# EAGLE design untitled (EAGLE 5.11)
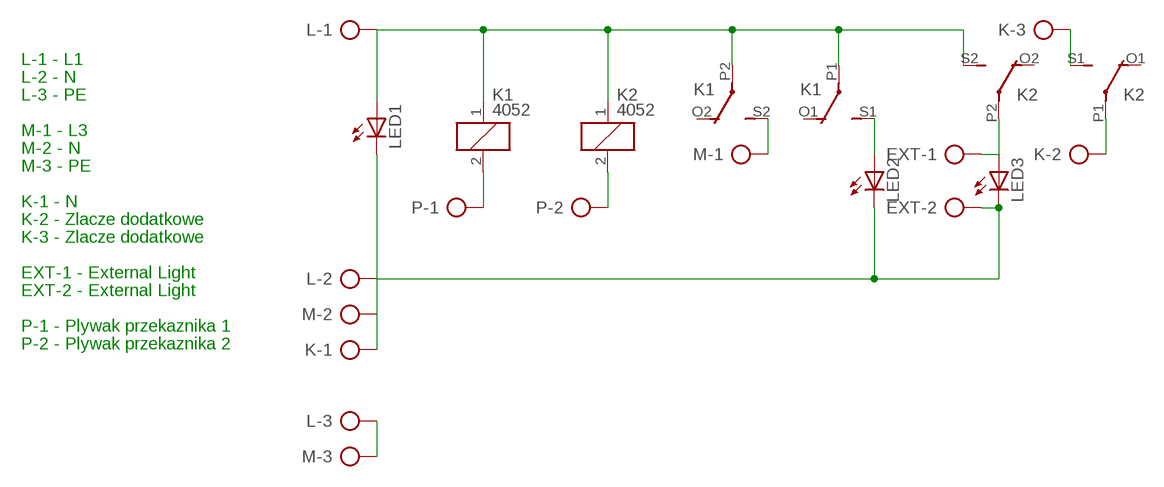
[diagram p0: schematic, sheet 1]

## Parts
EXT  AK500/2  [AK500/2]
K  AK500/3  [AK500/3]
K1  4052  [F4052]
K2  4052  [F4052]
L  AK500/3  [AK500/3]
LED1  1  [1]
LED2  1  [1]
LED3  1  [1]
M  AK500/3  [AK500/3]
P  AK500/2  [AK500/2]

## Nets
N$1: L.3 M.3
N$2: K1.1 K1.P1(2:P) K1.P2(3:P) K2.1 K2.S2(3:S) L.1 LED1.A
N$3: EXT.2 K.1 L.2 LED1.K(C) LED2.K(C) LED3.K(C) M.2
N$4: K1.2 P.1
N$5: K2.2 P.2
N$6: K1.S2(3:S) M.1
N$7: K1.S1(2:S) LED2.A
N$8: EXT.1 K2.P2(3:P) LED3.A
N$9: K2.S1(2:S) K.3
N$10: K2.P1(2:P) K.2
Unconnected: K1.O1(2:O) K1.O2(3:O) K2.O1(2:O) K2.O2(3:O)

## Notes on the sheet
- L-1 - L1
- L-2 - N
- L-3 - PE
- M-1 - L3
- M-2 - N
- M-3 - PE
- K-1 - N
- K-2 - Zlacze dodatkowe
- K-3 - Zlacze dodatkowe
- EXT-1 - External Light
- EXT-2 - External Light
- P-1 - Plywak przekaznika 1
- P-2 - Plywak przekaznika 2

## Library data of the parts
EXT P = con-ptr500:AK500/2: CONNECTOR; OC_FARNELL: unknown; OC_NEWARK: unknown
K L M = con-ptr500:AK500/3: CONNECTOR; OC_FARNELL: unknown; OC_NEWARK: unknown
K1 K2 = relay:4052: RELAY 2 x switch, Finder; OC_FARNELL: unknown; OC_NEWARK: unknown
LED1-LED3 = LEDm:1

## Board
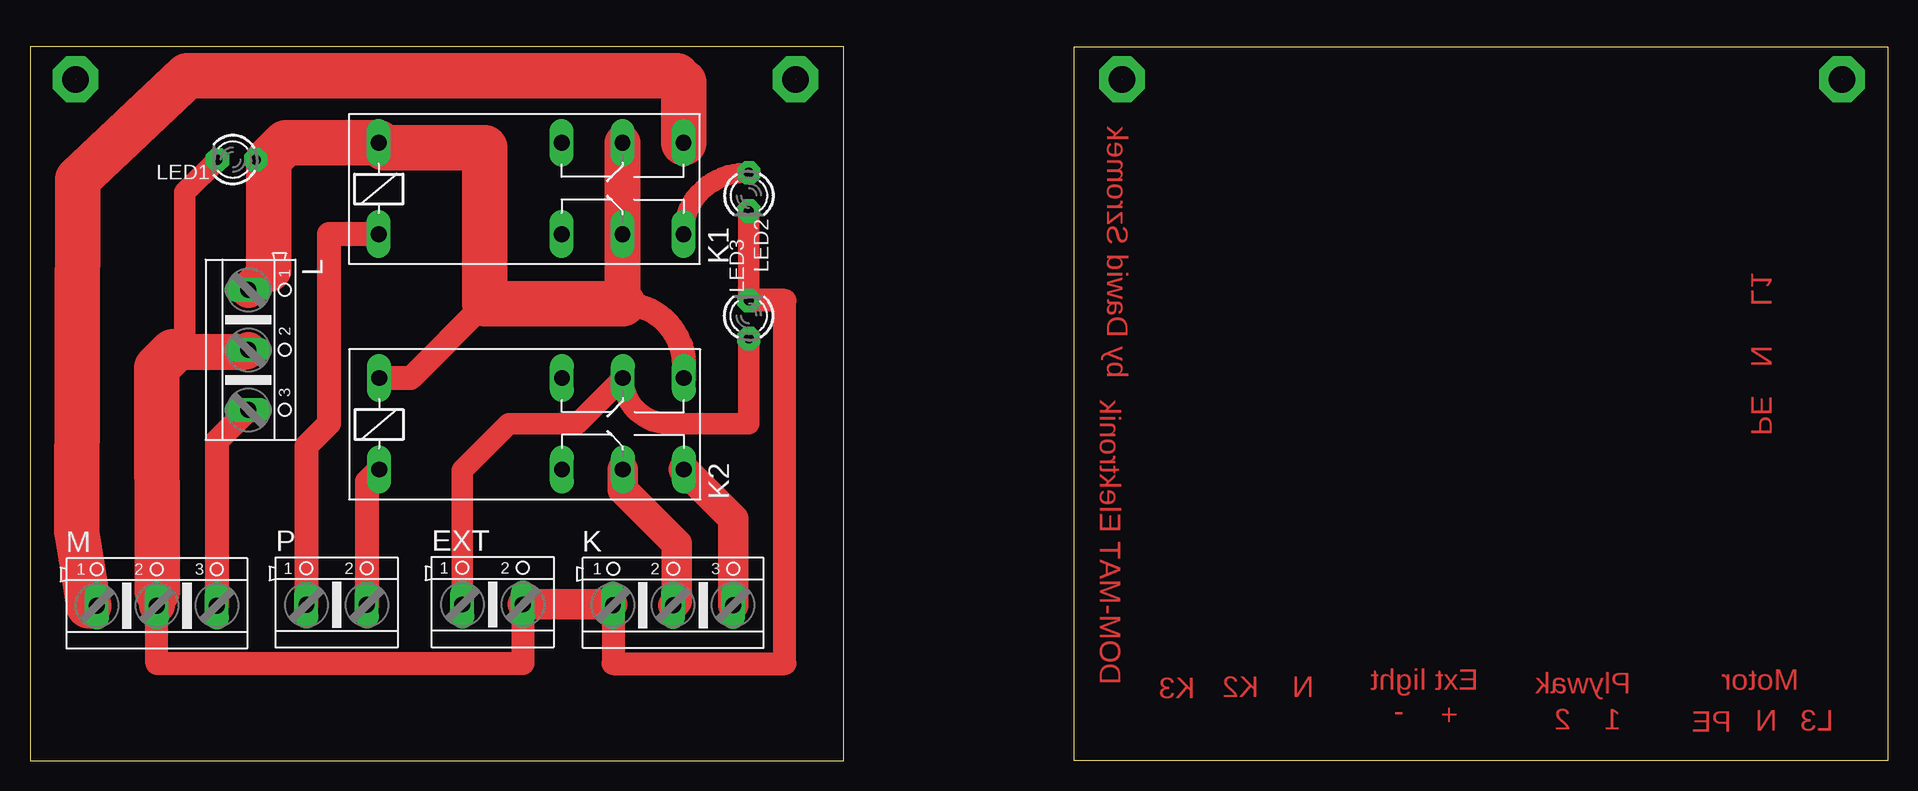
[diagram p1: board, top side]
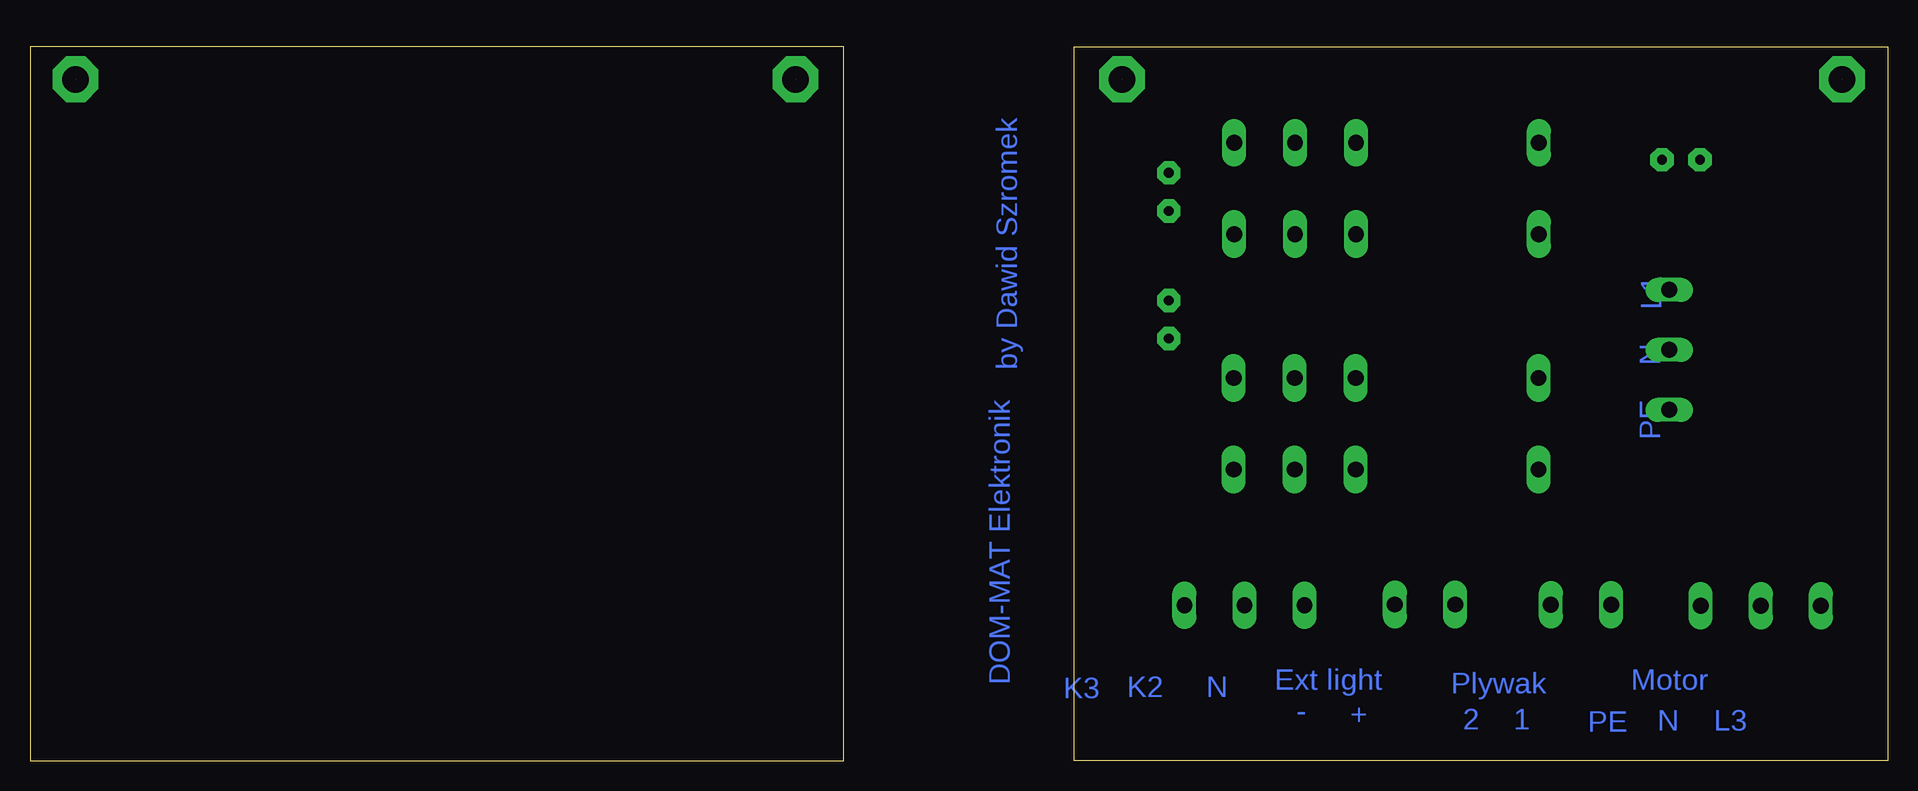
[diagram p2: board, bottom side, seen from below]

Size 154.8 x 59.5 mm. Coordinates in mm from the lower left corner, seen from the top.
Outline: 0,0 67.8,0 67.8,59.5 0,59.5 0,0
Outline: 154.8,0 87,0 87,59.5 154.8,59.5 154.8,0
Copper layers (1*16): Top 0.035mm / dielectric 1.5mm / Bottom 0.035mm
Design rules "default": minimum track width 10mil, minimum drill 24mil, track to track 8mil, track to pad 8mil, pad to pad 8mil, via to via 8mil, smd to smd 8mil, copper to edge 40mil, drill to drill 8mil, minimum pad ring 10mil, minimum via ring 8mil, stop-mask expansion 4mil, vias tented up to drill 0mil, thermal gap 10mil

### Footprints (pad centres in the part's own frame; a part is rotated, then mirrored left to right if it is on the bottom)
AK500/2 = drill 1.321 long: 1 -2.515,0; 2 2.515,0
AK500/3 = drill 1.321 long: 1 -5.004,0; 2 0,0; 3 5.004,0
F4052 = drill 1.321 long: 1 -3.81,3.81; 2 -3.81,-3.81; O1 11.43,-3.81; O2 11.43,3.81; P1 16.51,-3.81; P2 16.51,3.81; S1 21.59,-3.81; S2 21.59,3.81
1 = drill 0.813 pad 1.93 octagon: A -1.905,0; K 1.27,0

### Placement (x,y rotation side)
EXT  38.55,13.04 0 top
K  53.59,12.98 0 top
K1  32.87,47.71 0 top
K2  32.9,28.1 0 top
L  18.19,34.26 270 top
LED1  16.9,50.1 180 top
LED2  59.9,47.1 270 top
LED3  59.9,37.1 90 top
M  10.57,12.94 0 top
P  25.55,13.01 0 top

### Tracks (layer width: path | path; a pad name or v marks a point on that pad's centre or on a via)
N$1
  Top 2: L.3 15.57,26.64 M.3
N$2
  Top 1.778: 19.9,50.1 LED1.A
  Top 2: 37.9,38.1 31.71,31.91 K2.1 | 49.38,38.1 arc-90 54.49,32.99 K2.S2
  Top 3: L.1 19.9,40.97 | K1.1 29.48,51.1 | K1.P2 K1.P1 49.38,38.1
  Top 3.81: 19.9,40.97 19.9,50.1 21.32,51.52 K1.1 | 29.48,51.1 37.9,51.1 37.9,38.1 49.38,38.1
N$3
  Top 1.778: LED1.K 12.9,47.37 12.9,34.1 13.06,34.26 L.2 | LED3.K LED2.K
  Top 1.93: LED3.K 62.9,38.37 62.9,8.1 48.59,8.1 K.1 | EXT.2 41.06,8.1 10.57,8.1 M.2
  Top 2: 48.53,13.04 K.1
  Top 2.54: EXT.2 48.53,13.04
  Top 3: L.2 18.03,34.1 11.9,34.1 | M.2 10.6,12.94 10.6,14.1
  Top 3.81: 11.9,34.1 10.57,32.77 10.6,14.1
N$4
  Top 2: K1.2 24.9,43.9 24.9,28.1 23.04,26.24 P.1
N$5
  Top 2: K2.2 28.06,23.27 P.2
N$6
  Top 1.676: 4.9,12.94 M.1
  Top 3: 54.46,56.54 53.9,57.1
  Top 3.81: K1.S2 54.46,56.54 | 53.9,57.1 13.1,57.1 3.97,48.47 3.9,19.1 4.9,12.94
N$7
  Top 1.676: K1.S1 arc-90 59.56,49.01 LED2.A
N$8
  Top 1.778: LED3.A 59.9,28.1 53.22,28.1 arc-90 K2.P2 45.6,28.1 39.9,28.1 36.04,24.24 EXT.1
N$9
  Top 2.54: K2.S1 58.59,20.19 K.3
N$10
  Top 2.54: K2.P1 49.41,22.59 53.9,18.1 53.9,13.29 K.2
N$11  (2 unrouted)
N$12  (via drill 1.8)
  other vias: 175.8,15.8 175.8,15.8
N$13  (2 unrouted)
N$14  (via drill 2.2 pad 3.81)
  other vias: 176.9,15.1 63.8,56.8 3.8,56.8 91,56.8 151,56.8 64.9,77.1

### Text on the board
Top: by Dawid Szromek | L1 | N | DOM-MAT Elektronik | PE | Ext light | Motor | K3 | K2 | N | Plywak | - | + | 2 | 1 | PE | N | L3
Bottom: by Dawid Szromek | L1 | N | PE | DOM-MAT Elektronik | Motor | Ext light | Plywak | N | K2 | K3 | 1 | 2 | + | - | L3 | N | PE